# EAGLE design switch (EAGLE 7.1.0)
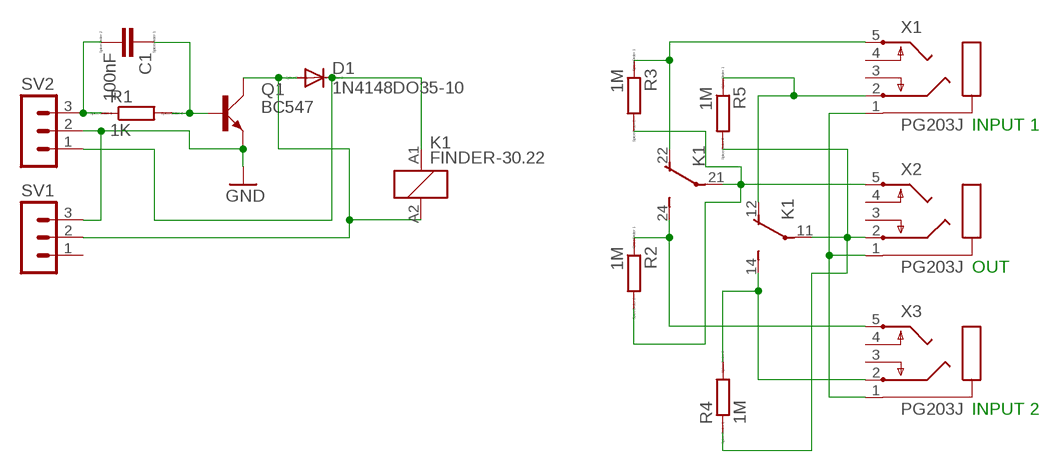
[diagram p0: schematic, sheet 1]

## Parts
C1  100nF  C-EU025-025X050  [C025-025X050]
D1  1N4148DO35-10  [DO35-10]
K1  FINDER-30.22  [FINDER-30.22]
Q1  BC547  [SOT54A]
R1  1K  R-EU_0207_10  [0207/10]
R2  1M  R-EU_0207_10  [0207/10]
R3  1M  R-EU_0207_10  [0207/10]
R4  1M  R-EU_0207_10  [0207/10]
R5  1M  R-EU_0207_10  [0207/10]
SV1  MA03-1  [MA03-1]
SV2  MA03-1  [MA03-1]
X1  PG203J  [PG203J]
X2  PG203J  [PG203J]
X3  PG203J  [PG203J]

## Nets
GND: Q1.E SV1.3 SV2.2
N$1: K1.22(-2:O) R3.1 X1.5
N$2: K1.24(-2:S) R2.1 X3.5
N$3: K1.11(-1:P) R4.1 R5.2 X2.2
N$4: D1.A K1.A2 Q1.C SV1.2
N$5: K1.12(-1:O) R5.1 X1.2
N$6: K1.14(-1:S) R4.2 X3.2
N$8: C1.2 R1.1 SV2.3
N$9: C1.1 Q1.B R1.2
N$10: X1.1 X2.1 X3.1
N$11: D1.C K1.A1 SV2.1
N$13: K1.21(-2:P) R2.2 R3.2 X2.5
Unconnected: SV1.1 X1.3 X1.4 X2.3 X2.4 X3.3 X3.4

## Notes on the sheet
- INPUT 1
- OUT
- INPUT 2

## Library data of the parts
C1 = resistor:C-EU: CAPACITOR, European symbol; SPICEPREFIX: C
D1 = diode:1N4148: DIODE high speed (Philips)
K1 = relay:FINDER-30.22: SUBMINIATURE DIL-RELAIS FINDER 30.22.9.024.0000 Kontakt max. AC - 125V Distributor: Farnell Bestell Nr.: 1217371 Source: http://www.farnell.com/datasheets/87634.pdf; OC_FARNELL: unknown; OC_NEWARK: unknown
Q1 = transistor-small-signal:BC547: NPN TRANSISTOR
R1-R5 = resistor:R-EU_: RESISTOR, European symbol; SPICEPREFIX: R
SV1 SV2 = con-lstb:MA03-1: PIN HEADER; OC_FARNELL: unknown; OC_NEWARK: unknown
X1-X3 = con-hirschmann:PG203J: MIC/HEADPHONE JACK KS-S stereo microphone/headphone jack PG203JN (Schukat); OC_FARNELL: unknown; OC_NEWARK: unknown

## Board
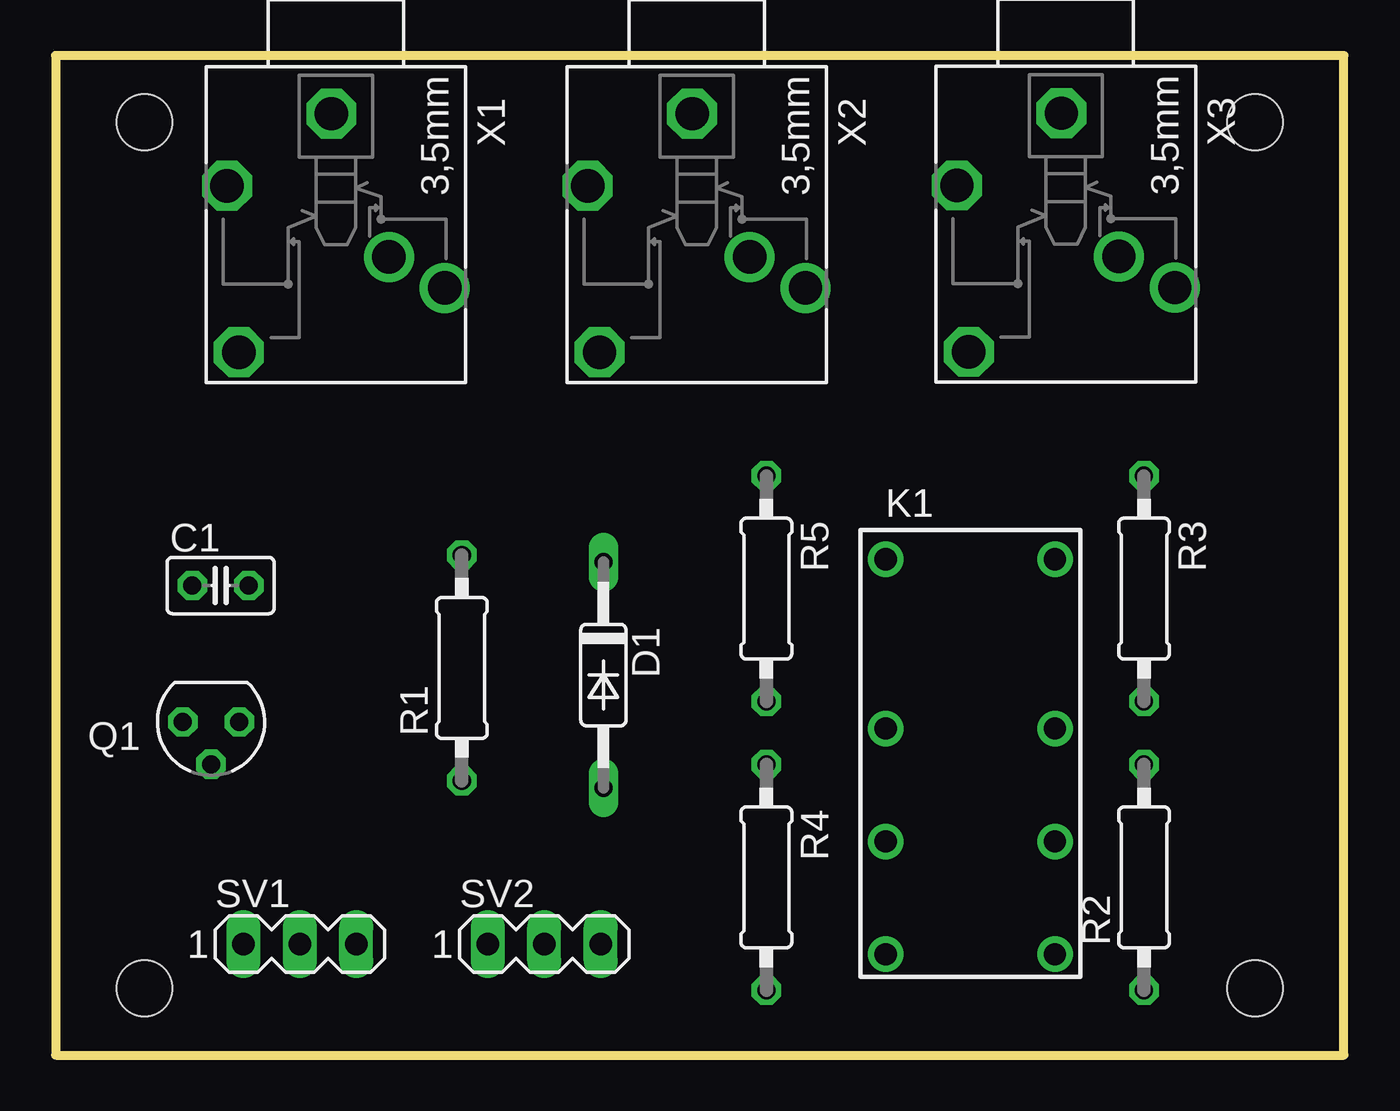
[diagram p1: board, top side]
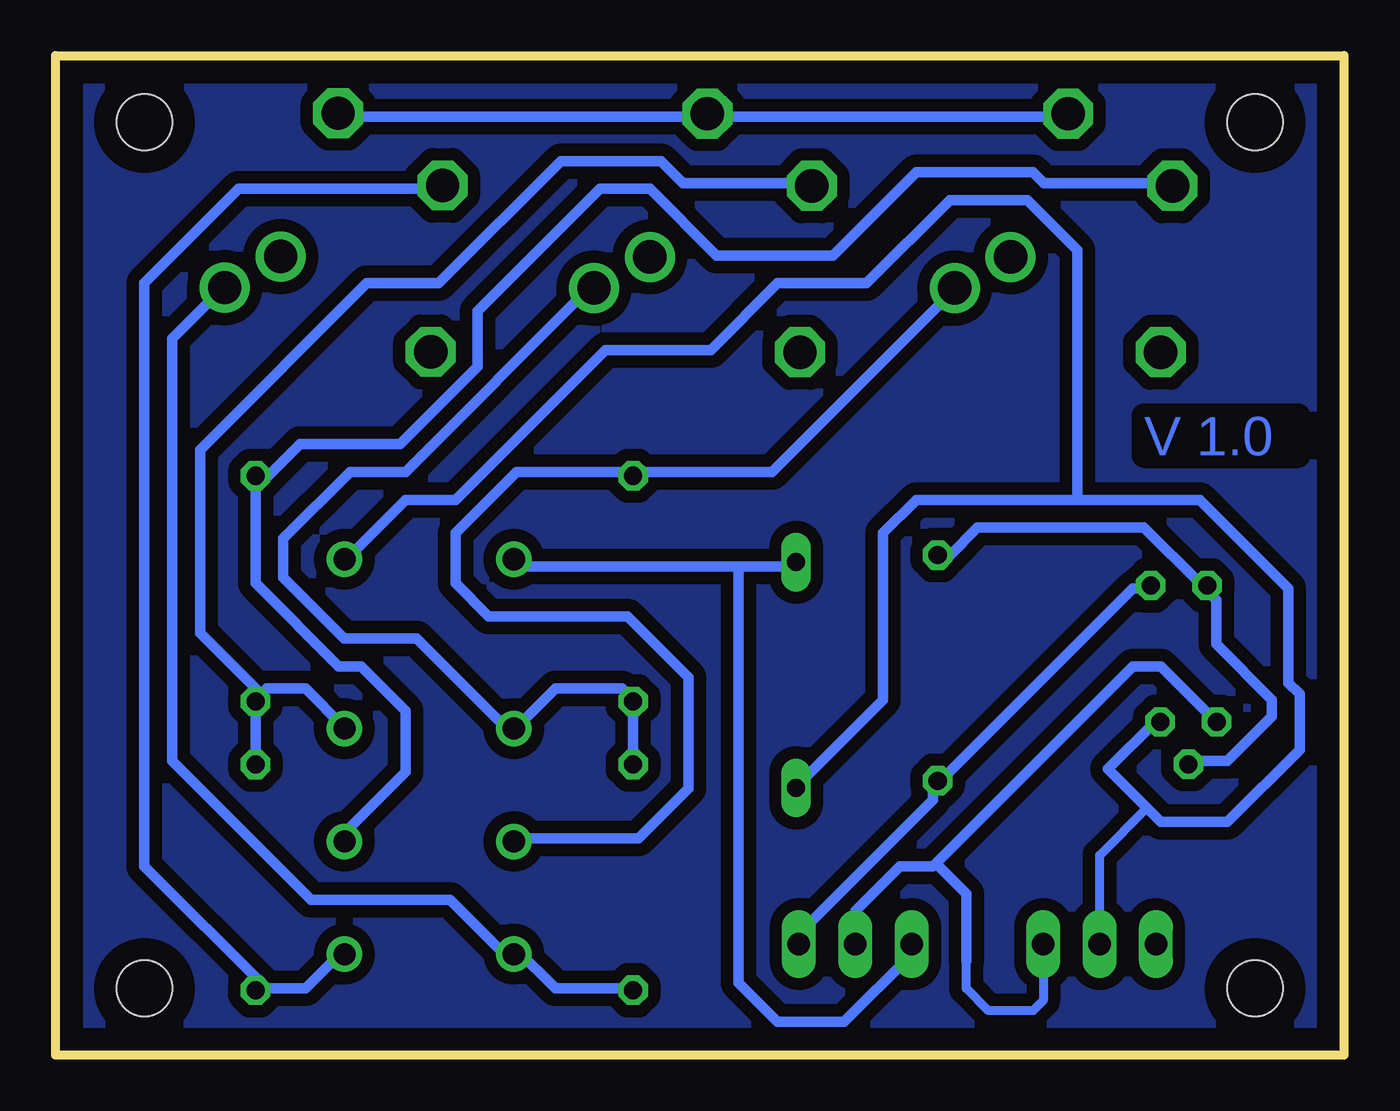
[diagram p2: board, bottom side, seen from below]

Size 58 x 45 mm. Coordinates in mm from the lower left corner, seen from the top.
Outline: 0,0 58,0 58,45 0,45 0,0
Copper layers (1*16): Top 0.035mm / dielectric 1.5mm / Bottom 0.035mm
Design rules "default *": minimum track width 19mil, minimum drill 24mil, track to track 22mil, track to pad 22mil, pad to pad 8mil, via to via 8mil, smd to smd 8mil, copper to edge 40mil, drill to drill 8mil, minimum pad ring 10mil, minimum via ring 8mil, stop-mask expansion 4mil, vias tented up to drill 0mil, thermal gap 10mil
Holes 2.5 mm at 4,3 54,3 54,42 4,42

### Footprints (pad centres in the part's own frame; a part is rotated, then mirrored left to right if it is on the bottom)
C025-025X050 = drill 0.813 octagon: 1 -1.27,0; 2 1.27,0
DO35-10 = drill 0.813 long: A 5.08,0; C -5.08,0
FINDER-30.22 = drill 1 pad 1.6: 11 -1.27,-3.81; 12 3.81,-3.81; 14 8.89,-3.81; 21 -1.27,3.81; 22 3.81,3.81; 24 8.89,3.81; A1 -8.89,-3.81; A2 -8.89,3.81
SOT54A = drill 0.813 octagon: B 0,1.905; C -1.27,0; E 1.27,0
0207/10 = drill 0.813 octagon: 1 -5.08,0; 2 5.08,0
MA03-1 = drill 1.016 long: 1 -2.54,0; 2 0,0; 3 2.54,0
PG203J = drill 1.499 octagon: 1 -5.004,-0.203; 4 5.74,-4.369; 5 -1.753,-4.902 | drill 1.499: 2 2.845,4.902; 3 1.448,2.388

### Placement (x,y rotation side)
C1  7.43,21.14 0 top
D1  24.66,17.11 270 top
K1  41.18,13.43 270 top
Q1  7,15 180 top
R1  18.29,17.43 90 top
R2  49,8 90 top
R3  49,21 270 top
R4  32,8 270 top
R5  32,21 270 top
SV1  11,5 0 top
SV2  22,5 0 top
X1  12.62,37.38 270 top
X2  28.86,37.38 270 top
X3  45.48,37.4 270 top

### Tracks (layer width: path | path; a pad name or v marks a point on that pad's centre or on a via)
GND
  Bottom 0.406: SV1.3 13.54,2.46 14,2 16,2 17,3 17,4.25
  Bottom 0.483: 18.38,8.62 18.5,8.5 20,8.5 22,6.5 SV2.2 | 18.38,8.62 9.5,17.5 8.25,17.5 5.75,15 Q1.E | 17,4.25 17,7.25 18.38,8.62
N$1
  Bottom 0.483: 49,25.5 49,21.25 45.25,17.5 44.25,17.5 42.25,15.5 42.25,12.75 44.75,10.25 44.75,9.75 K1.22 | 49,25.5 R3.1 49,26 | 49,25.5 47,27.5 42.5,27.5 39,31 39,33.5 33.5,39 31.25,39 28.25,36 23,36 19.25,39.75 14,39.75 13.5,39.25 7.75,39.25 X1.5
N$2
  Bottom 0.483: 48.5,3 46.75,3 45,4.75 K1.24 | 48.5,3 49,3 R2.1 48.5,3 | 48.5,3 54,8.5 54,34.75 49.75,39 40.75,39 X3.5
N$3
  Bottom 0.483: R4.1 R5.2 32,16 32.5,16.5 35.5,16.5 37.25,14.75 K1.11 37.5,14.5 41.75,18.75 45,18.75 47.75,21.5 47.75,23.25 44.75,26.25 42.25,26.25 34,34.5 X2.2
N$4
  Bottom 0.406: SV1.2 11,9 8.88,11.12
  Bottom 0.483: Q1.C 8.5,15 10.62,12.88 8.88,11.12 8.25,10.5 5.25,10.5 2,13.75 2,16.25 2.5,16.75 2.5,21 6.5,25 12,25 | 12,25 19.25,25 20.75,23.5 20.75,16 24.5,12.25 D1.A | 12,25 12,36.25 14.25,38.5 17.75,38.5 21.5,34.75 25.5,34.75 28.5,31.75 33.25,31.75 40,25 42.25,25 44.75,22.5 K1.A2
N$5
  Bottom 0.483: 32,26.25 25.75,26.25 17.5,34.5 X1.2 | 32,26.25 37.25,26.25 40,23.5 40,21.25 38.5,19.75 32.25,19.75 29.5,17 29.5,12 31.75,9.75 37.25,9.75 K1.12 | 32,26.25 R5.1
N$6
  Bottom 0.483: R4.2 32,3 35.5,3 37.25,4.75 K1.14 37.5,4.75 38,4.75 40.25,7 46.5,7 52.75,13.25 52.75,32.25 50.5,34.5 X3.2
N$7
  pour Bottom: 1,44 57,44 57,1 1,1
N$8
  Bottom 0.483: SV2.3 24.5,5 24.5,5.5 18.5,11.5 18.5,12.25 R1.1 18.25,12.25 9.5,21 8.75,21 C1.2
N$9
  Bottom 0.483: R1.2 18.25,22.5 17.75,22.5 16.5,23.75 9,23.75 6.5,21.25 6.25,21.25 C1.1 6.25,21 5.75,20.5 5.75,18.5 3.25,16 3.25,15.25 5.25,13.25 7,13.25 Q1.B
N$10
  Bottom 0.483: X1.1 12.5,42.25 28.5,42.25 X2.1 28.75,42.25 45.25,42.25 X3.1
N$11
  Bottom 0.483: 27.25,22 37,22 37.25,22.25 K1.A1 | 27.25,22 24.75,22 D1.C | 27.25,22 27.25,3.25 25.5,1.5 22.5,1.5 19.5,4.5 19.5,5 SV2.1
N$13
  Bottom 0.483: R3.2 R2.2 | 48.75,16.25 49,16 R3.2 | 48.75,16.25 48.5,16.5 46.75,16.5 45,14.75 K1.21 | 48.75,16.25 51.5,19 51.5,27.25 44,34.75 40.75,34.75 35.25,40.25 30.75,40.25 29.75,39.25 24,39.25 X2.5 | 48.75,16.25 R3.2

### Text on the board
Bottom: V 1.0